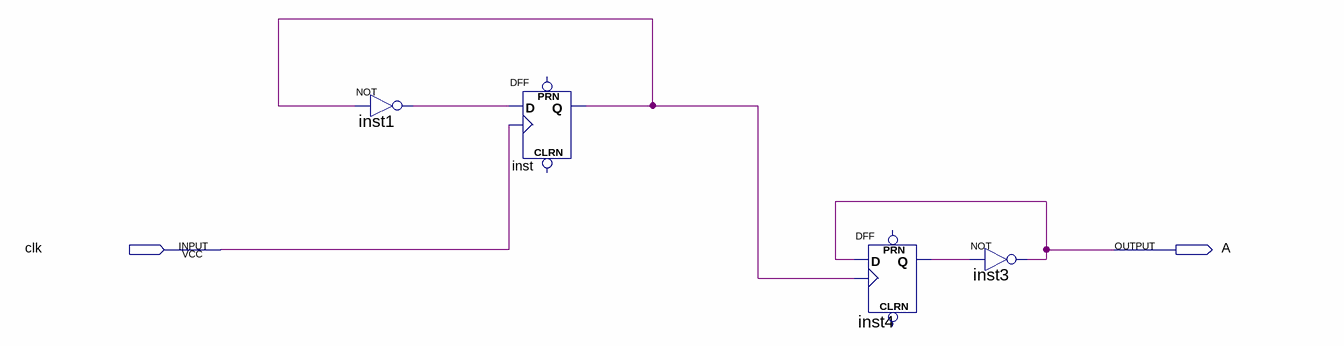
[diagram p0: schematic sheet]
// Quartus schematic 4Xdec.bdf as structural Verilog: 4 symbols, 2 pins
module \4Xdec  (
  input  clk,
  output A
);

  wire inst1_out, inst4_q, inst_q;

  not inst1 (inst1_out, inst_q);
  DFF inst (.CLK(clk), .D(inst1_out), .Q(inst_q));  // open: CLRN, PRN
  DFF inst4 (.CLK(inst_q), .D(A), .Q(inst4_q));  // open: CLRN, PRN
  not inst3 (A, inst4_q);
endmodule
